# Altium schematic sheet MCU.SchDoc: MCU
size A4; ApprovedBy: Maduranga Mathara Arachchi; CheckedBy: Maduranga Mathara Arachchi; Author: Maduranga Mathara Arachchi; CompanyName: Maduranga Mathara Arachchi; DrawnBy: Maduranga Mathara Arachchi; Engineer: Maduranga Mathara Arachchi; Organization: Maduranga Mathara Arachchi; Address1: 17/21, Gnanawimala Road,; Address2: Athurugiriya; Address3: Colombo,; Address4: Sri Lanka.; DocumentNumber: 1; Revision: 0.1; SheetNumber: 5; SheetTotal: 7
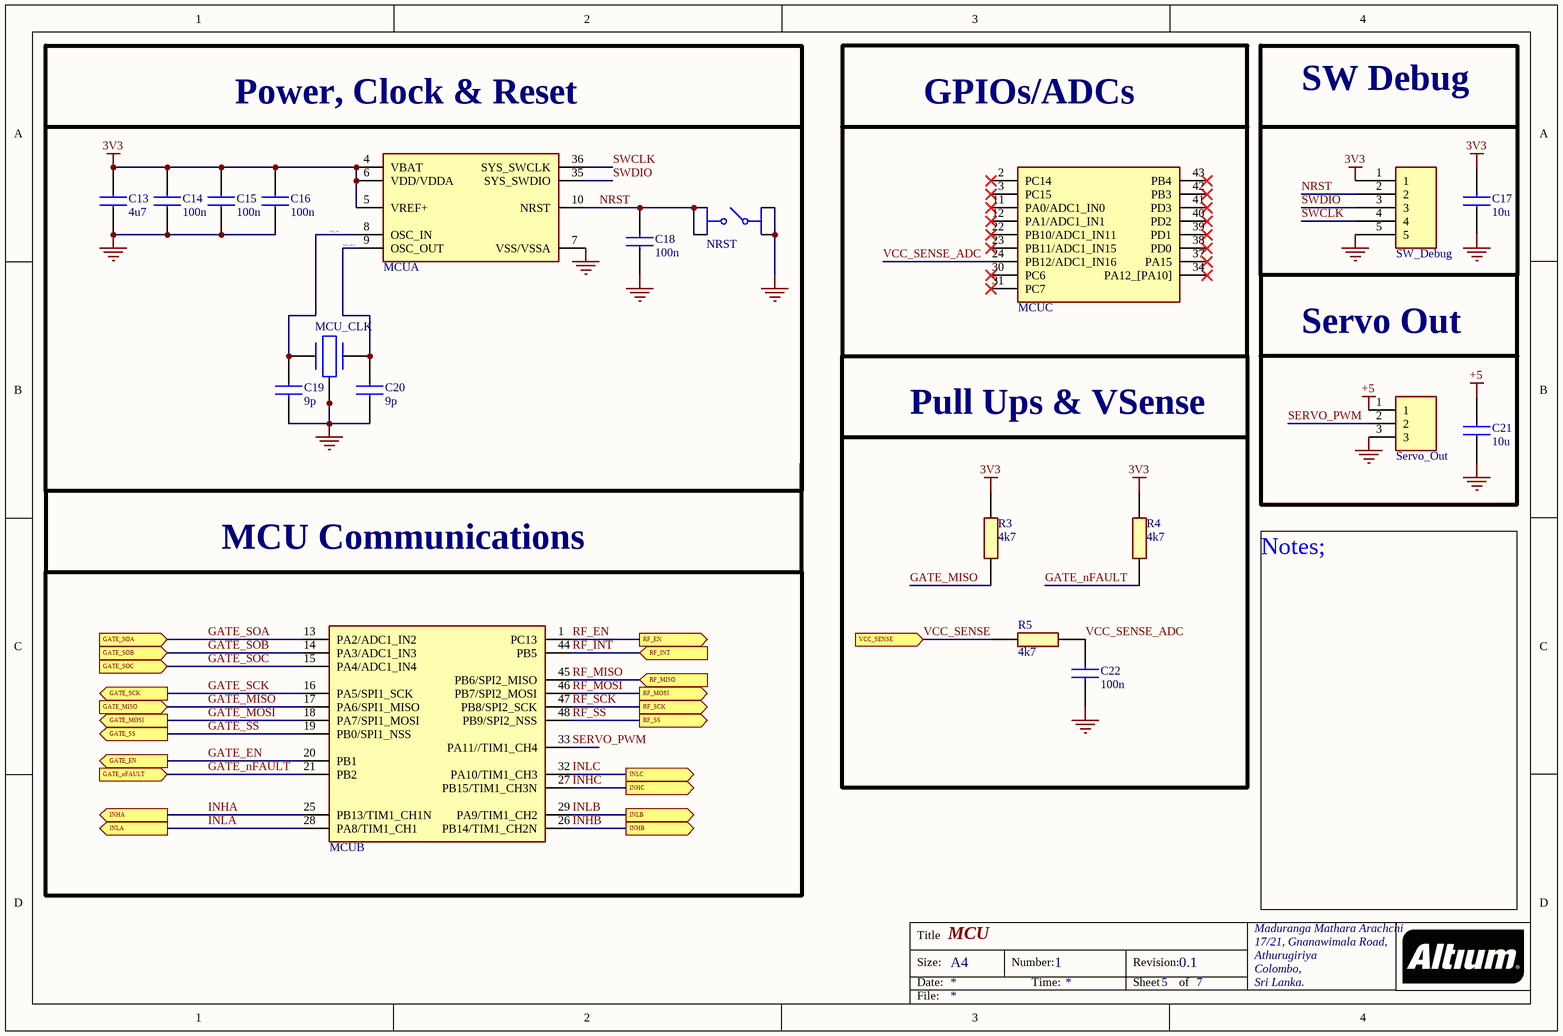
[diagram p0: MCU.SchDoc]

## Parts
C13  4u7  [CAPC1608X90N]
C14  100n  [GRM18x]
C15  100n  [GRM18x]
C16  100n  [GRM18x]
C17  10u  [CAPC1608X90N]
C18  100n  [GRM18x]
C19  9p  [CAPC1005X70N]
C20  9p  [CAPC1005X70N]
C21  10u  [CAPC1608X90N]
C22  100n  [GRM18x]
MCU  STM32G070CBT6TR  [QFP50P900X900X160-48N]  (value not drawn)  (parts A,B,C of 3)
MCU_CLK  TSX-3225_16.0000MF18X-AC0  [TSX3225160000MF18XAC0]  (value not drawn)
NRST  PTS647SM50SMTR2N_LFS  [PTS647SK50SMTR2LFS]  (value not drawn)
R3  4k7  [RESC1608X50N]
R4  4k7  [RESC1608X50N]
R5  4k7  [RESC1608X50N]
Servo_Out  929850-01-03-RA  [RHDR3W76P0X254_1X3_762X254X826P]  (value not drawn)
SW_Debug  SW Debug  [SW_Debug]  (value not drawn)  (no BOM)

## Blocks framed on the sheet
Power, Clock & Reset: C13-C16 C18-C20 MCU MCU_CLK NRST
GPIOs/ADCs: MCU
SW Debug: C17 SW_Debug

## Ports
GATE_EN (out), GATE_MISO (in), GATE_MOSI (out), GATE_nFAULT (in), GATE_SCK (out), GATE_SOA (in), GATE_SOB (in), GATE_SOC (in), GATE_SS (out), INHA (out), INHB (out), INHC (out), INLA (out), INLB (out), INLC (out), RF_EN (out), RF_INT (in), RF_MISO (in), RF_MOSI (out), RF_SCK (out), RF_SS (out), VCC_SENSE (in)

## Nets
3V3: C13.1 C14.2 C15.2 C16.2 C17.2 MCU.4(VBAT) MCU.5(VREF+) MCU.6(VDD/VDDA) R3.2 R4.2 SW_Debug.1
+5: C21.2 Servo_Out.1
GND: C13.2 C14.1 C15.1 C16.1 C17.1 C18.1 C19.1 C20.1 C21.1 C22.1 MCU.7(VSS/VSSA) MCU_CLK.2(GND_1) MCU_CLK.4(GND_2) NRST.3(COM_1) NRST.4(COM_2) Servo_Out.3 SW_Debug.5
GATE_EN: MCU.20(PB1) ; port GATE_EN
GATE_MISO: MCU.17(PA6/SPI1_MISO) R3.1 ; port GATE_MISO
GATE_MOSI: MCU.18(PA7/SPI1_MOSI) ; port GATE_MOSI
GATE_nFAULT: MCU.21(PB2) R4.1 ; port GATE_nFAULT
GATE_SCK: MCU.16(PA5/SPI1_SCK) ; port GATE_SCK
GATE_SOA: MCU.13(PA2/ADC1_IN2) ; port GATE_SOA
GATE_SOB: MCU.14(PA3/ADC1_IN3) ; port GATE_SOB
GATE_SOC: MCU.15(PA4/ADC1_IN4) ; port GATE_SOC
GATE_SS: MCU.19(PB0/SPI1_NSS) ; port GATE_SS
INHA: MCU.25(PB13/TIM1_CH1N) ; port INHA
INHB: MCU.26(PB14/TIM1_CH2N) ; port INHB
INHC: MCU.27(PB15/TIM1_CH3N) ; port INHC
INLA: MCU.28(PA8/TIM1_CH1) ; port INLA
INLB: MCU.29(PA9/TIM1_CH2) ; port INLB
INLC: MCU.32(PA10/TIM1_CH3) ; port INLC
NRST: C18.2 MCU.10(NRST) NRST.1(NO_1) NRST.2(NO_2) SW_Debug.2
OSC_IN: C19.2 MCU.8(OSC_IN) MCU_CLK.1(CRYSTAL_1)
OSC_OUT: C20.2 MCU.9(OSC_OUT) MCU_CLK.3(CRYSTAL_2)
RF_EN: MCU.1(PC13) ; port RF_EN
RF_INT: MCU.44(PB5) ; port RF_INT
RF_MISO: MCU.45(PB6/SPI2_MISO) ; port RF_MISO
RF_MOSI: MCU.46(PB7/SPI2_MOSI) ; port RF_MOSI
RF_SCK: MCU.47(PB8/SPI2_SCK) ; port RF_SCK
RF_SS: MCU.48(PB9/SPI2_NSS) ; port RF_SS
SERVO_PWM: MCU.33(PA11//TIM1_CH4) Servo_Out.2
SWCLK: MCU.36(SYS_SWCLK) SW_Debug.4
SWDIO: MCU.35(SYS_SWDIO) SW_Debug.3
VCC_SENSE: R5.2 ; port VCC_SENSE
VCC_SENSE_ADC: C22.2 MCU.24(PB12/ADC1_IN16) R5.1

Not connected (* = marked no-connect by the designer): MCU 2(PC14)* 3(PC15)* 11(PA0/ADC1_IN0)* 12(PA1/ADC1_IN1)* 22(PB10/ADC1_IN11)* 23(PB11/ADC1_IN15)* 30(PC6)* 31(PC7)* 34(PA12_[PA10])* 37(PA15)* 38(PD0)* 39(PD1)* 40(PD2)* 41(PD3)* 42(PB3)* 43(PB4)*

## Notes on the sheet
- Servo Out
- Pull Ups & VSense
- MCU Communications
- Notes;
- Title
- Size:
- Date:
- A4
- Number:
- Time:
- Revision:
- Sheet
- of
- File:

## Library data of the parts
C13 = GRM188R61E475ME11J: Capacitor; Manufacturer_Name: Murata Electronics; Datasheet Link: https://search.murata.co.jp/Ceramy/image/img/A01X/G101/ENG/GRM188R61E475ME11-01A.pdf; Height: 0.9mm; Manufacturer_Part_Number: GRM188R61E475ME11J; Mouser Part Number: 81-GRM188R61E475ME1J; Mouser Price/Stock: https://www.mouser.co.uk/ProductDetail/Murata-Electronics/GRM188R61E475ME11J?qs=qSfuJ%252Bfl%2Fd5xnSEcMLhPZA%3D%3D; Arrow Part Number: GRM188R61E475ME11J; Arrow Price/Stock: https://www.arrow.com/en/products/grm188r61e475me11j/murata-manufacturing?region=nac
C14-C16 C18 C22 = GRM188R72A104KA35D: Capacitor; Manufacturer_Name: Murata Electronics; Datasheet Link: https://search.murata.co.jp/Ceramy/image/img/A01X/G101/ENG/GRM188R72A104KA35-01A.pdf; Height: 0.9mm; Manufacturer_Part_Number: GRM188R72A104KA35D; Mouser Part Number: 81-GRM188R72A104KA35; Mouser Price/Stock: https://www.mouser.co.uk/ProductDetail/Murata-Electronics/GRM188R72A104KA35D?qs=P%252BBA3F6RM%2F5aaC9LFKRzYw%3D%3D; Arrow Part Number: GRM188R72A104KA35D; Arrow Price/Stock: https://www.arrow.com/en/products/grm188r72a104ka35d/murata-manufacturing?utm_currency=USD&region=nac
C17 C21 = C0603C106M9PAC-TU: Capacitor; Manufacturer_Name: KEMET; Datasheet Link: https://componentsearchengine.com/Datasheets/2/C0603C106M9PAC-TU.pdf; Height: 0.9mm; Manufacturer_Part_Number: C0603C106M9PAC-TU
C19 C20 = GRM1555C1E9R0WA01J: Capacitor; Manufacturer_Name: Murata Electronics; Datasheet Link: http://www.murata.com/~/media/webrenewal/support/library/catalog/products/capacitor/mlcc/c02e.pdf; Height: 0.7mm; Manufacturer_Part_Number: GRM1555C1E9R0WA01J
MCU = STM32G070CBT6TR: Integrated Circuit; Manufacturer_Name: STMicroelectronics; Datasheet Link: https://www.st.com/resource/en/datasheet/stm32g070cb.pdf; Height: 1.6mm; Manufacturer_Part_Number: STM32G070CBT6TR; Mouser Part Number: 511-STM32G070CBT6TR; Mouser Price/Stock: https://www.mouser.co.uk/ProductDetail/STMicroelectronics/STM32G070CBT6TR?qs=xZ%2FP%252Ba9zWqZMnP7ZLxt7Tg%3D%3D; Arrow Part Number: STM32G070CBT6TR; Arrow Price/Stock: https://www.arrow.com/en/products/stm32g070cbt6tr/stmicroelectronics?utm_currency=USD&region=nac
MCU_CLK = TSX-3225_16.0000MF18X-AC0: 16MHz Crystal; Manufacturer_Name: Epson Timing; Manufacturer_Part_Number: TSX-3225 16.0000MF18X-AC0; Datasheet Link: https://www.digikey.ph/en/products/detail/epson/TSX-3225-16-0000MF18X-AC0/5260855; Height: 0.6mm; Mouser Part Number: 732-322516F18XAC0; Mouser Price/Stock: https://www.mouser.co.uk/ProductDetail/Epson-Timing/TSX-3225-16.0000MF18X-AC0?qs=wwacUt%252BV97taurHtFwy%2FEA%3D%3D; Arrow Part Number: TSX-3225 16.0000MF18X-AC0; Arrow Price/Stock: https://www.arrow.com/en/products/tsx-322516.0000mf18x-ac0/epson-electronics-america?utm_currency=USD&region=nac
NRST = PTS647SM50SMTR2N_LFS: Switch (4-Pin Push); Manufacturer_Name: C & K COMPONENTS; Manufacturer_Part_Number: PTS647SM50SMTR2N LFS; Datasheet Link: https://www.ckswitches.com/media/2567/pts647.pdf
R3-R5 = CRCW06034K70FKEC: Resistor; Manufacturer_Name: Vishay; Datasheet Link: http://www.vishay.com/docs/20035/dcrcwe3.pdf; Height: 0.5mm; Manufacturer_Part_Number: CRCW06034K70FKEC; Mouser Part Number: 71-CRCW06034K70FKEC; Mouser Price/Stock: https://www.mouser.co.uk/ProductDetail/Vishay-Dale/CRCW06034K70FKEC?qs=L%252B14cgJd8NPi5InG5zfNWw%3D%3D; Arrow Part Number: CRCW06034K70FKEC; Arrow Price/Stock: https://www.arrow.com/en/products/crcw06034k70fkec/vishay?utm_currency=USD&region=nac
Servo_Out = 929850-01-03-RA: Header; Manufacturer_Name: 3M; Datasheet Link: https://multimedia.3m.com/mws/media/22500O/3mtm-boardmount-skt-100-100x-100strt-sldr-tails-ts0815.pdf; Height: 8.26mm; Manufacturer_Part_Number: 929850-01-03-RA; Mouser Part Number: 517-929850-01-03-RA; Mouser Price/Stock: https://www.mouser.co.uk/ProductDetail/3M-Electronic-Solutions-Division/929850-01-03-RA?qs=neFkstNq%252B6HSkhIqD4w5cg%3D%3D; Arrow Part Number: 929850-01-03-RA; Arrow Price/Stock: https://www.arrow.com/en/products/929850-01-03-ra/3m?region=nac
SW_Debug = Debug Pads